# Altium schematic sheet AuxiliaryPowerSupply.SchDoc
size A4; SheetNumber: 2; SheetTotal: 5
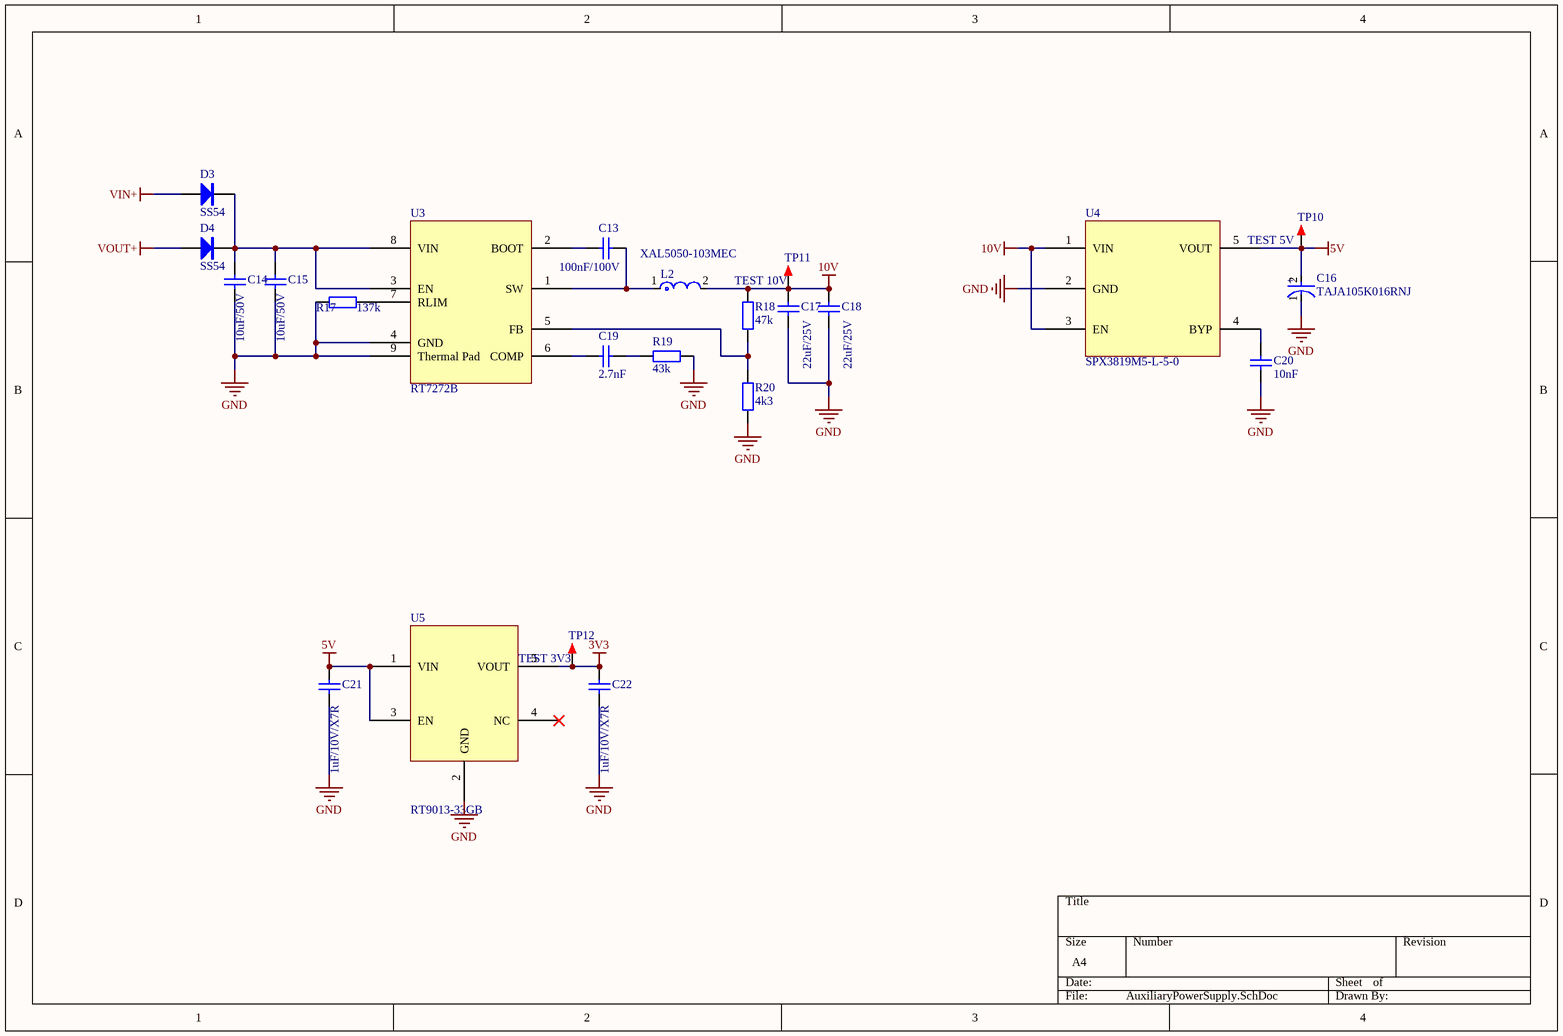
[diagram p0: AuxiliaryPowerSupply.SchDoc]

## Parts
C13  100nF/100V  [C0402_L]
C14  10uF/50V  [C1206_L]
C15  10uF/50V  [C1206_L]
C16  TAJA105K016RNJ  [FP-TAJA-MFG]
C17  22uF/25V  [C0805_L]
C18  22uF/25V  [C0805_L]
C19  2.7nF  [C0402_L]
C20  10nF  [C0402_L]
C21  1uF/10V/X7R  [C0402_L]
C22  1uF/10V/X7R  [C0402_L]
D3  SS54  [SMA]
D4  SS54  [SMA]
L2  XAL5050-103MEC  [FP-XAL5050-MFG]
R17  137k  [R0402_L]
R18  47k  [R0402_L]
R19  43k  [R0402_L]
R20  4k3  [R0402_L]
TP10  TEST 5V  [TEST TP1.4_W]
TP11  TEST 10V  [TEST TP1.4_W]
TP12  TEST 3V3  [TEST TP1.4_W]
U3  RT7272B  [RT7272B]
U4  SPX3819M5-L-5-0  [SPX3819M5-L-5-0]
U5  RT9013-33GB  [RT9013-33GB]

## Nets
3V3: C22.2 TP12.1 U5.5(VOUT)
5V: C16.2(A) C21.2 TP10.1 U4.5(VOUT) U5.1(VIN) U5.3(EN)
10V: C17.2 C18.2 L2.2 R18.1 TP11.1 U4.1(VIN) U4.3(EN)
GND: C14.1 C15.1 C16.1(C) C17.1 C18.1 C20.2 C21.1 C22.1 R17.1 R19.1 R20.1 U3.4(GND) U3.9(Thermal_Pad) U4.2(GND) U5.2(GND)
VIN+: D3.1(A)
VOUT+: D4.1(A)
NetC13_1: C13.1 L2.1 U3.1(SW)
NetC13_2: C13.2 U3.2(BOOT)
NetC14_2: C14.2 C15.2 D3.2(K) D4.2(K) U3.3(EN) U3.8(VIN)
NetC19_1: C19.1 R19.2
NetC19_2: C19.2 U3.6(COMP)
NetC20_1: C20.1 U4.4(BYP)
NetR17_2: R17.2 U3.7(RLIM)
NetR18_2: R18.2 R20.2 U3.5(FB)

Not connected (* = marked no-connect by the designer): U5 4(NC)*

## Notes on the sheet
- (in symbol CMP-04424-000051-2) +

## Library data of the parts
C13-C15 C17-C22 = C: 贴片电容; BOM名称: 无极性贴片电容; 联系卖家，免费查找封装: 唯一出售店铺网址https://shop463601444.taobao.com
C16 = CMP-04424-000051-2: CAP TANT 1UF 10% 16V 1206; Tolerance: 20%; Dielectric Material: Tantalum; Leakage Current: 500nA; ESR (Equivalent Series Resistance): 11R; Dissipation Factor: 4%; Polarity: Polar; Series: TAJ; Case/Package: 1206; Capacitance: 1uF; Case Code (Metric): 3216; Lead Pitch: 1.1mm; Voltage: 16V; Depth: 1.6mm; Min Operating Temperature: -55°C; Voltage Rating: 16V; Termination: SMD/SMT; Mount: Surface Mount; Number of Pins: 2; Features: General Purpose; Height - Seated (Max): 0.071inch; RoHS Compliant: Yes; Weight: 0.000571oz; Voltage Rating (DC): 16V; Width: 1.6mm; Max Operating Temperature: 125°C; Lead Free: Lead Free; Radiation Hardening: No; REACH SVHC: No SVHC; Packaging: Tape and Reel; Package Quantity: 1; Case Code (Imperial): 1206; Length: 3.2mm; Height: 1.6mm
D3 D4 = SS14: 肖特基二极管; 版权归属: 源创客; 属性: 40V/1A; BOM名称: 肖特基二极管; 学习资源: www.ooocke.com
L2 = CMP-11268-000215-1: Shielded Power Inductors 10uH 20% 4.9A 45mOhm; Self Resonant Frequency: 15MHz; Test Frequency: 100kHz; Core Material: Composite; DC Resistance (DCR): 45mR; Series: XAL5050; Termination: SMD/SMT; Tolerance: 20%; Inductance Tolerance: 20%; RMS Current (Irms): 4.9A; Width: 5.48mm; Mount: Surface Mount; Min Operating Temperature: -40°C; Max Operating Temperature: 125°C; RoHS Compliant: Yes; Saturation Current: 4.9A; Lead Free: Contains Lead; Max DC Current: 4.9A; Shielding: Shielded; Packaging: Tape and Reel; Length: 5.68mm; Package Quantity: 250; Case/Package: SMD/SMT; Inductance: 10uH; Height: 5.1mm; Reach SVHC Compliant: Yes
R17-R20 = R: 贴片电阻; 联系卖家，免费查找封装: 唯一出售店铺网址https://shop463601444.taobao.com; BOM名称: 贴片电阻
TP10-TP12 = TEST TP: 测试环; 联系卖家，免费查找封装: 唯一出售店铺网址https://shop463601444.taobao.com; 封装库来自淘宝卖家ID：黄晶宝石: 其他店铺购入均为盗版假冒封装库，请立即申请退款; BOM名称: 测试环